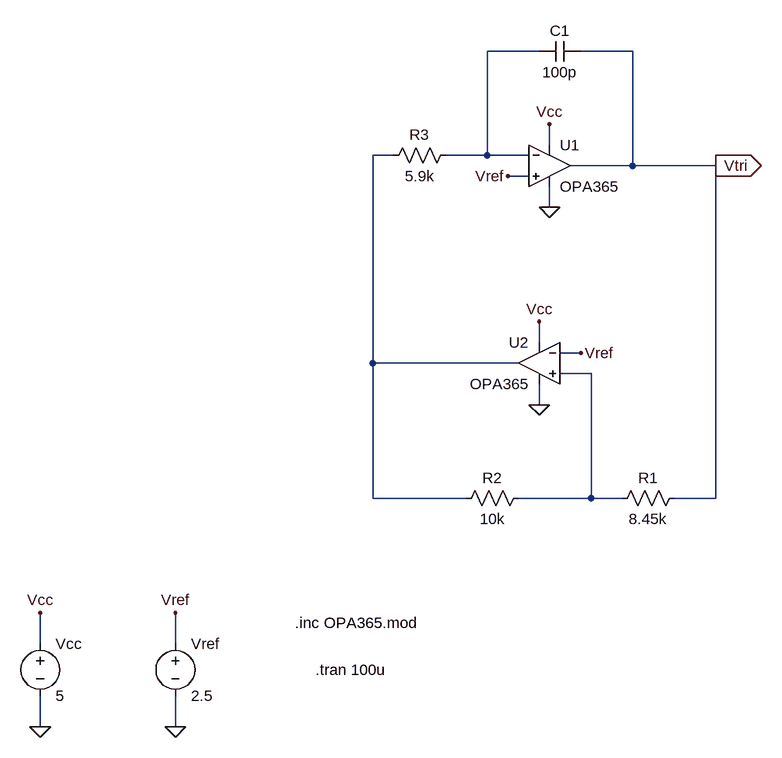
[diagram p0: schematic sboa212_LTSPICE_triangle.asc]
sboa212_LTSPICE_triangle.asc, the LTspice schematic file:
Version 4
SHEET 1 880 708
WIRE 288 -352 208 -352
WIRE 432 -352 352 -352
WIRE 304 -208 304 -240
WIRE 64 -192 32 -192
WIRE 208 -192 208 -352
WIRE 208 -192 144 -192
WIRE 272 -192 208 -192
WIRE 432 -176 432 -352
WIRE 432 -176 336 -176
WIRE 560 -176 432 -176
WIRE 272 -160 240 -160
WIRE 304 -112 304 -144
WIRE 288 96 288 64
WIRE 352 112 320 112
WIRE 32 128 32 -192
WIRE 256 128 32 128
WIRE 368 144 320 144
WIRE 288 192 288 160
WIRE 32 336 32 128
WIRE 176 336 32 336
WIRE 368 336 368 144
WIRE 368 336 256 336
WIRE 416 336 368 336
WIRE 560 336 560 -176
WIRE 560 336 496 336
WIRE -480 560 -480 512
WIRE -272 560 -272 512
WIRE -480 688 -480 640
WIRE -272 688 -272 640
FLAG -480 688 0
FLAG -480 512 Vcc
FLAG -272 688 0
FLAG -272 512 Vref
FLAG 304 -240 Vcc
FLAG 304 -112 0
FLAG 240 -160 Vref
FLAG 352 112 Vref
FLAG 288 64 Vcc
FLAG 288 192 0
FLAG 560 -176 Vtri
IOPIN 560 -176 Out
SYMBOL voltage -480 544 R0
WINDOW 123 0 0 Left 0
WINDOW 39 0 0 Left 0
SYMATTR InstName Vcc
SYMATTR Value 5
SYMBOL voltage -272 544 R0
WINDOW 123 0 0 Left 0
WINDOW 39 0 0 Left 0
SYMATTR InstName Vref
SYMATTR Value 2.5
SYMBOL Opamps\\opamp2 304 -240 R0
SYMATTR InstName U1
SYMATTR Value OPA365
SYMBOL res 400 352 R270
WINDOW 0 32 56 VTop 2
WINDOW 3 0 56 VBottom 2
SYMATTR InstName R1
SYMATTR Value 8.45k
SYMATTR SpiceLine tol=1 pwr=1
SYMBOL res 160 352 R270
WINDOW 0 32 56 VTop 2
WINDOW 3 0 56 VBottom 2
SYMATTR InstName R2
SYMATTR Value 10k
SYMATTR SpiceLine tol=1 pwr=1
SYMBOL res 48 -176 R270
WINDOW 0 32 56 VTop 2
WINDOW 3 0 56 VBottom 2
SYMATTR InstName R3
SYMATTR Value 5.9k
SYMATTR SpiceLine tol=1 pwr=1
SYMBOL cap 352 -368 R90
WINDOW 0 0 32 VBottom 2
WINDOW 3 32 32 VTop 2
SYMATTR InstName C1
SYMATTR Value 100p
SYMBOL Opamps\\opamp2 288 64 M0
SYMATTR InstName U2
SYMATTR Value OPA365
TEXT -88 528 Left 2 !.inc OPA365.mod
TEXT -56 600 Left 2 !.tran 100u

The netlist it stands for:
* sboa212_LTSPICE_triangle.asc
Vcc Vcc 0 5
Vref Vref 0 2.5
XU1 Vref N001 Vcc 0 Vtri OPA365  ; pins In+ In- V+ V- OUT
R1 N003 Vtri 8.45k tol=1 pwr=1
R2 N002 N003 10k tol=1 pwr=1
R3 N002 N001 5.9k tol=1 pwr=1
C1 Vtri N001 100p
XU2 N003 Vref Vcc 0 N002 OPA365  ; pins In+ In- V+ V- OUT
.inc OPA365.mod
.tran 100u
.backanno
.end